# EAGLE design proudovyzdroj (EAGLE 9.5.1)
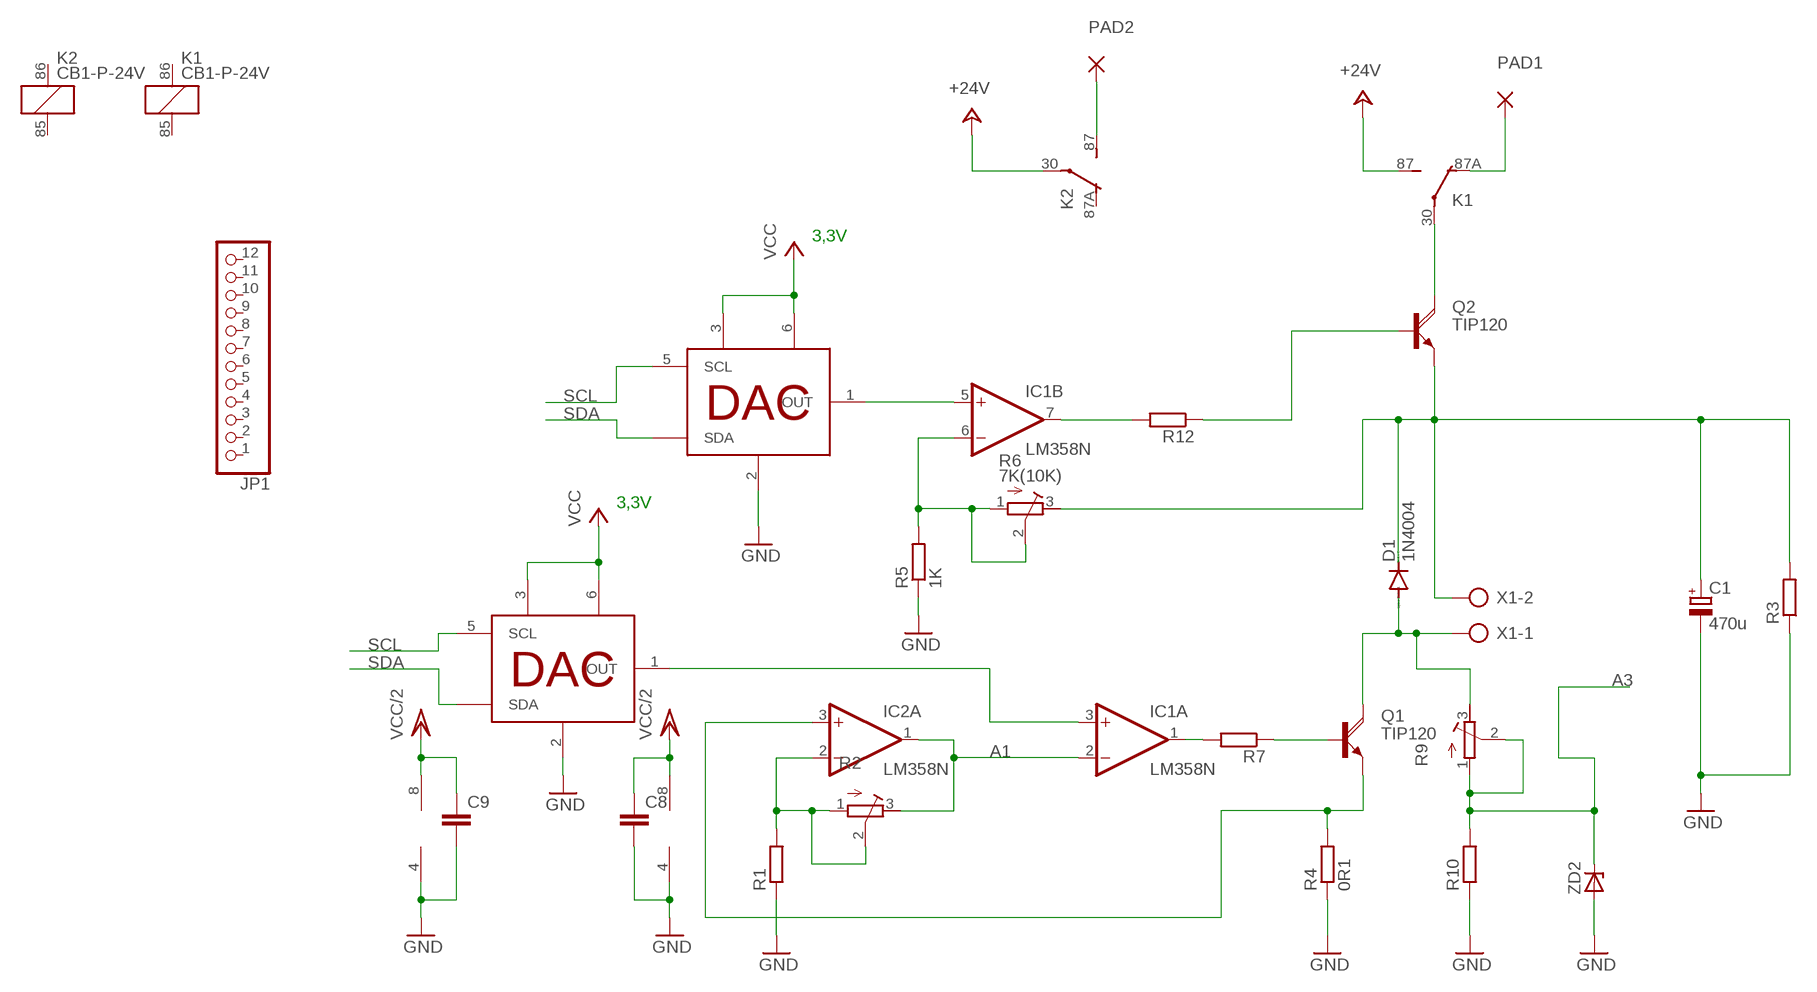
[diagram p0: schematic, sheet 1]

## Parts
C1  470u  CPOL-EUE3.5-8  [E3,5-8]
C8  C-EUC0805  [C0805]
C9  C-EUC0805  [C0805]
D1  1N4004  [DO41-10]
IC1  LM358N  [DIL08]
IC2  LM358N  [DIL08]
JP1  PINHD-1X12  [1X12]
K1  CB1-P-24V  [CB1]
K2  CB1-P-24V  [CB1]
PAD1  3,81/1,4  [3,81/1,4]
PAD2  3,81/1,4  [3,81/1,4]
Q1  TIP120  [TO220AH]
Q2  TIP120  [TO220AH]
R1  R-EU_M0805  [M0805]
R2  R-TRIMM3339P  [RTRIM3339P]
R3  R-EU_R0805  [R0805]
R4  0R1  R-EU_0411/15  [0411/15]
R5  1K  R-EU_R0805  [R0805]
R6  7K(10K)  R-TRIMM3339P  [RTRIM3339P]
R7  R-EU_R0805  [R0805]
R9  R-TRIMM3339P  [RTRIM3339P]
R10  R-EU_R0805  [R0805]
R12  R-EU_R0805  [R0805]
U$5  MCP4726  [TSOT23-6]
U$6  MCP4726  [TSOT23-6]
X1  AK500/2  [AK500/2]
ZD2  DIODE_ZENER5  [DO34-5]

## Nets
+24V: K1.87(2:S) K2.30(2:P)
A1: IC1.2(A:-IN) IC2.1(A:OUT) R2.3(E)
A3: R9.1(A) R9.2(S) R10.2 ZD2.C
GND: C1.- C8.2 C9.2 IC1.4(P:V-) IC2.4(P:V-) R1.1 R3.1 R4.1 R5.1 R10.1 U$5.2(VSS) U$6.2(VSS) ZD2.A
N$1: IC2.3(A:+IN) Q1.E R4.2
N$2: IC1.1(A:OUT) R7.2
N$3: IC2.2(A:-IN) R1.2 R2.1(A) R2.2(S)
N$4: Q2.B R12.1
N$5: Q1.B R7.1
N$6: IC1.3(A:+IN) U$5.1(OUT)
N$7: D1.A Q1.C R9.3(E) X1.1
N$8: K1.30(2:P) Q2.C
N$9: IC1.5(B:+IN) U$6.1(OUT)
N$10: K1.87A(2:O) PAD1.1(P)
N$11: IC1.6(B:-IN) R5.2 R6.1(A) R6.2(S)
N$12: IC1.7(B:OUT) R12.2
N$13: C1.+ D1.C Q2.E R3.2 R6.3(E) X1.2
N$14: K2.87(2:S) PAD2.1(P)
SCL: U$5.5(SCL) U$6.5(SCL)
SDA: U$5.4(SDA) U$6.4(SDA)
VCC: U$5.3(VDD) U$5.6(VREF) U$6.3(VDD) U$6.6(VREF)
VCC/2: C8.1 C9.1 IC1.8(P:V+) IC2.8(P:V+)
Unconnected: IC2.5(B:+IN) IC2.6(B:-IN) IC2.7(B:OUT) JP1.1 JP1.2 JP1.3 JP1.4 JP1.5 JP1.6 JP1.7 JP1.8 JP1.9 JP1.10 JP1.11 JP1.12 K1.85 K1.86 K2.85 K2.86 K2.87A(2:O)

## Notes on the sheet
- 3,3V
- 3,3V

## Library data of the parts
C1 = rcl:CPOL-EU: POLARIZED CAPACITOR, European symbol; SPICEPREFIX: C
C8 C9 = rcl:C-EU: CAPACITOR, European symbol; SPICEPREFIX: C
D1 = diode:1N4004: DIODE general purpose rectifier, 1 A
IC1 IC2 = linear:LM358: OP AMP also LM158; LM258; LM2904 Source: http://cache.national.com/ds/LM/LM158.pdf
JP1 = pinhead:PINHD-1X12: PIN HEADER
K1 K2 = relay:CB1*: HIGH POWER AUTOMOTIVE RELAY Form C NAiS Source: http://www.mew-europe.com/.. en_ds_61202_0000.pdf; MF: AROMAT/ MATSUSHITA; MPN: CB1-P-24V; OC_FARNELL: 4168987; OC_NEWARK: 07C0827
PAD1 PAD2 = wirepad:3,81/1,4: THROUGH-HOLE PAD
Q1 Q2 = transistor-power:TIP120: NPN DARLINGTON TRANSISTOR
R1 = rcl_my:R-EU_: RESISTOR, European symbol
R2 R6 R9 = rcl:R-TRIMM: Trimm resistor; SPICEMODEL: X; SPICEPREFIXL: POT
R3-R5 R7 R10 R12 = rcl:R-EU_: RESISTOR, European symbol; SPICEPREFIX: R
U$5 U$6 = DAC:MCP4726
X1 = con-ptr500:AK500/2: CONNECTOR; OC_FARNELL: unknown; OC_NEWARK: unknown
ZD2 = devices:DIODE_ZENER

## Board
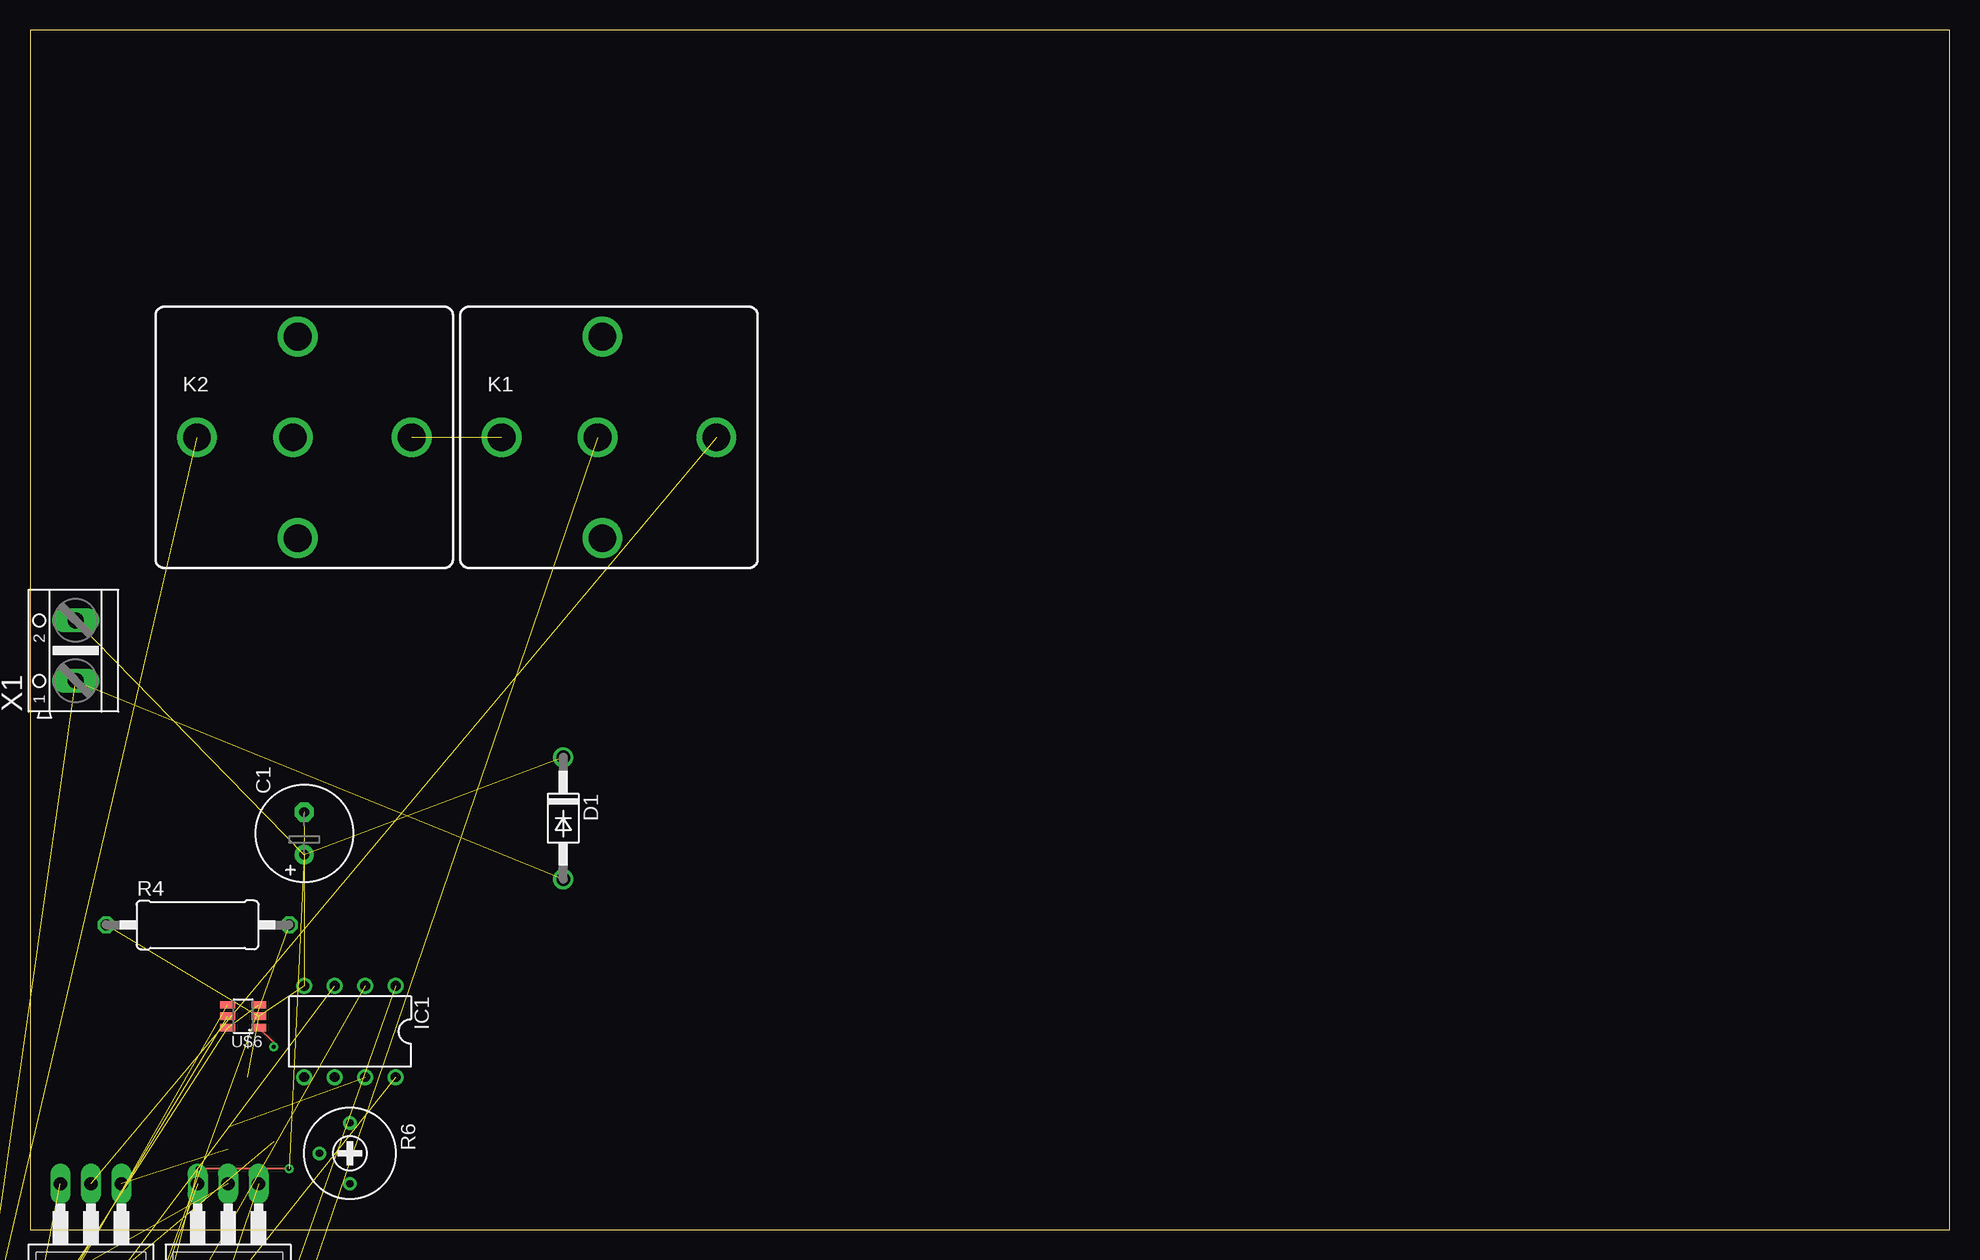
[diagram p1: board, top side]
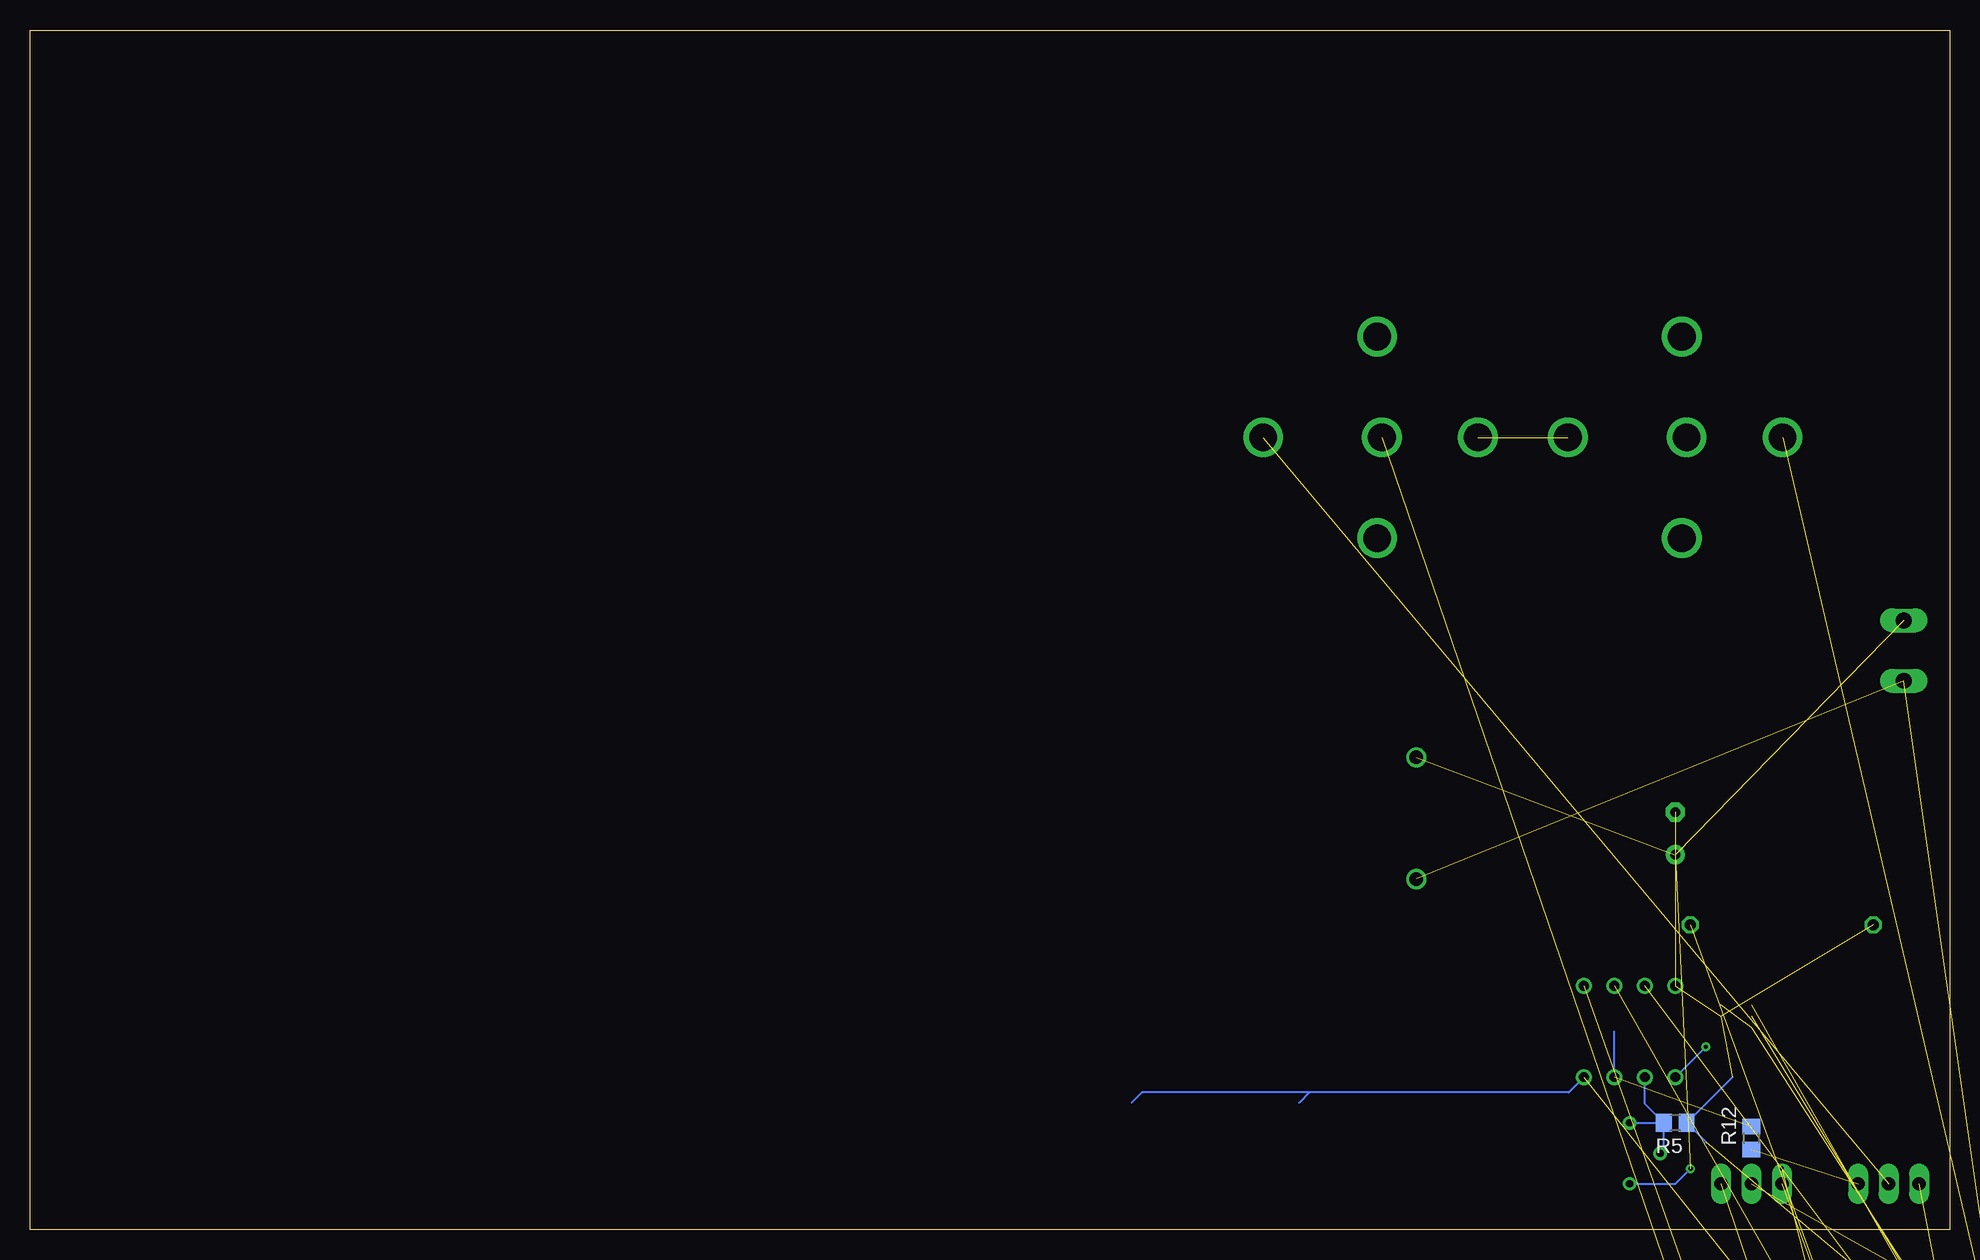
[diagram p2: board, bottom side, seen from below]

Size 160 x 100 mm. Coordinates in mm from the lower left corner, seen from the top.
Outline: 0,0 160,0 160,100 0,100 0,0
Copper layers (1*16): Top 0.035mm / dielectric 1.5mm / Bottom 0.035mm
Design rules "default": minimum track width 6mil, minimum drill 0.35mm, track to track 6mil, track to pad 6mil, pad to pad 6mil, via to via 6mil, smd to smd 6mil, copper to edge 40mil, drill to drill 6mil, minimum pad ring 10mil, minimum via ring 8mil, stop-mask expansion 4mil, vias tented up to drill 0mil, thermal gap 10mil

### Footprints (pad centres in the part's own frame; a part is rotated, then mirrored left to right if it is on the bottom)
E3,5-8 = drill 0.813 pad 1.6: + -1.778,0 | drill 0.813 pad 1.6 octagon: - 1.778,0
C0805 = smd 1.3 x 1.5: 1 -0.95,0; 2 0.95,0
DO41-10 = drill 1.118: A 5.08,0; C -5.08,0
DIL08 = drill 0.813 pad 1.27: 1 -3.81,-3.81; 2 -1.27,-3.81; 3 1.27,-3.81; 4 3.81,-3.81; 5 3.81,3.81; 6 1.27,3.81; 7 -1.27,3.81; 8 -3.81,3.81
1X12 = drill 1.016 long: 1 -13.97,0; 2 -11.43,0; 3 -8.89,0; 4 -6.35,0; 5 -3.81,0; 6 -1.27,0; 7 1.27,0; 8 3.81,0; 9 6.35,0; 10 8.89,0; 11 11.43,0; 12 13.97,0
CB1 = drill 2.3: 30 8.95,0; 85 -0.55,-8.4; 86 -0.55,8.4; 87 -8.95,0; 87A -0.95,0
3,81/1,4 = drill 1.397 pad 3.81 octagon: 1 0,0
TO220AH = drill 1.118 long: B -2.54,-6.35; C 0,-6.35; E 2.54,-6.35 | hole 3.302: 0,11.176
M0805 = smd 1.3 x 1.6: 1 -0.95,0; 2 0.95,0
RTRIM3339P = drill 0.61: 1 -2.54,0; 2 0,-2.54; 3 2.54,0
R0805 = smd 1.3 x 1.5: 1 -0.95,0; 2 0.95,0
0411/15 = drill 0.914 octagon: 1 -7.62,0; 2 7.62,0
TSOT23-6 = smd 0.62 x 1.22: 1 -0.95,-1.3; 2 0,-1.3; 3 0.95,-1.3; 4 0.95,1.3; 5 0,1.3; 6 -0.95,1.3
AK500/2 = drill 1.321 long: 1 -2.515,0; 2 2.515,0
DO34-5 = drill 0.813 long: A 2.54,0; C -2.54,0

### Placement (x,y rotation side)
C1  22.86,33.02 90 top
C8  -27.94,-121.92 0 top  (outside the outline)
C9  -27.94,-127 0 top  (outside the outline)
D1  44.45,34.29 270 top
IC1  26.67,16.51 180 top
IC2  -5.08,-40.64 0 top  (outside the outline)
JP1  -35.56,-198.12 0 top  (outside the outline)
K1  48.26,66.04 0 top
K2  22.86,66.04 0 top
PAD1  -62.23,-254 0 top  (outside the outline)
PAD2  -62.23,-260.35 0 top  (outside the outline)
Q1  16.51,-2.54 180 top
Q2  5.08,-2.54 180 top
R1  -36.83,-187.96 0 top  (outside the outline)
R2  -35.56,-177.8 0 top  (outside the outline)
R3  -36.83,-193.04 0 top  (outside the outline)
R4  13.97,25.4 0 top
R5  22.86,8.89 180 bottom
R6  26.67,6.35 270 top
R7  -49.53,-203.2 0 top  (outside the outline)
R9  -6.35,-7.62 0 top  (outside the outline)
R10  -10.16,-19.05 0 top  (outside the outline)
R12  16.51,7.62 90 bottom
U$5  -8.89,-25.4 0 top  (outside the outline)
U$6  17.78,17.78 90 top
X1  3.81,48.26 90 top
ZD2  -25.4,-71.12 0 top  (outside the outline)

### Tracks (layer width: path | path; a pad name or v marks a point on that pad's centre or on a via)
+24V  (1 unrouted)
A1  (2 unrouted)
A3  (3 unrouted)
GND  (12 unrouted)
  Bottom 0.152: 18.1,12.7 R5.1 20.32,7.3
N$1  (2 unrouted)
N$2  (1 unrouted)
N$3  (3 unrouted)
N$4  (1 unrouted)
N$5  (1 unrouted)
N$6  (1 unrouted)
N$7  (3 unrouted)
N$8  (1 unrouted)
N$9  (via drill 0.35)
  Top 0.152: U$6.1 20.32,15.59 v20.32,15.24
  Bottom 0.152: IC1.5 v20.32,15.24
N$10  (1 unrouted)
N$11
  Bottom 0.152: R5.2 25.4,10.48 IC1.6 | R6.1 R5.2 | R6.2 23.81,6.67 R5.2
N$12  (1 unrouted)
  Bottom 0.152: IC1.7 27.94,16.51
N$13  (via drill 0.35)  (5 unrouted)
  Top 0.152: v21.59,5.08 v13.97,5.08
  Bottom 0.152: R6.3 22.86,3.81 v21.59,5.08
N$14  (1 unrouted)
SCL  (1 unrouted)
SDA  (1 unrouted)
VCC  (3 unrouted)
VCC/2  (3 unrouted)
  Bottom 0.152: IC1.8 31.75,11.43 53.34,11.43 | 53.34,11.43 67.31,11.43 68.17,10.57 | 54.2,10.57 53.34,11.43